# Altium schematic sheet Connectors&Periph.SchDoc: Hi
size A4 portrait; Cel: Ehh; Projektant: Teodor
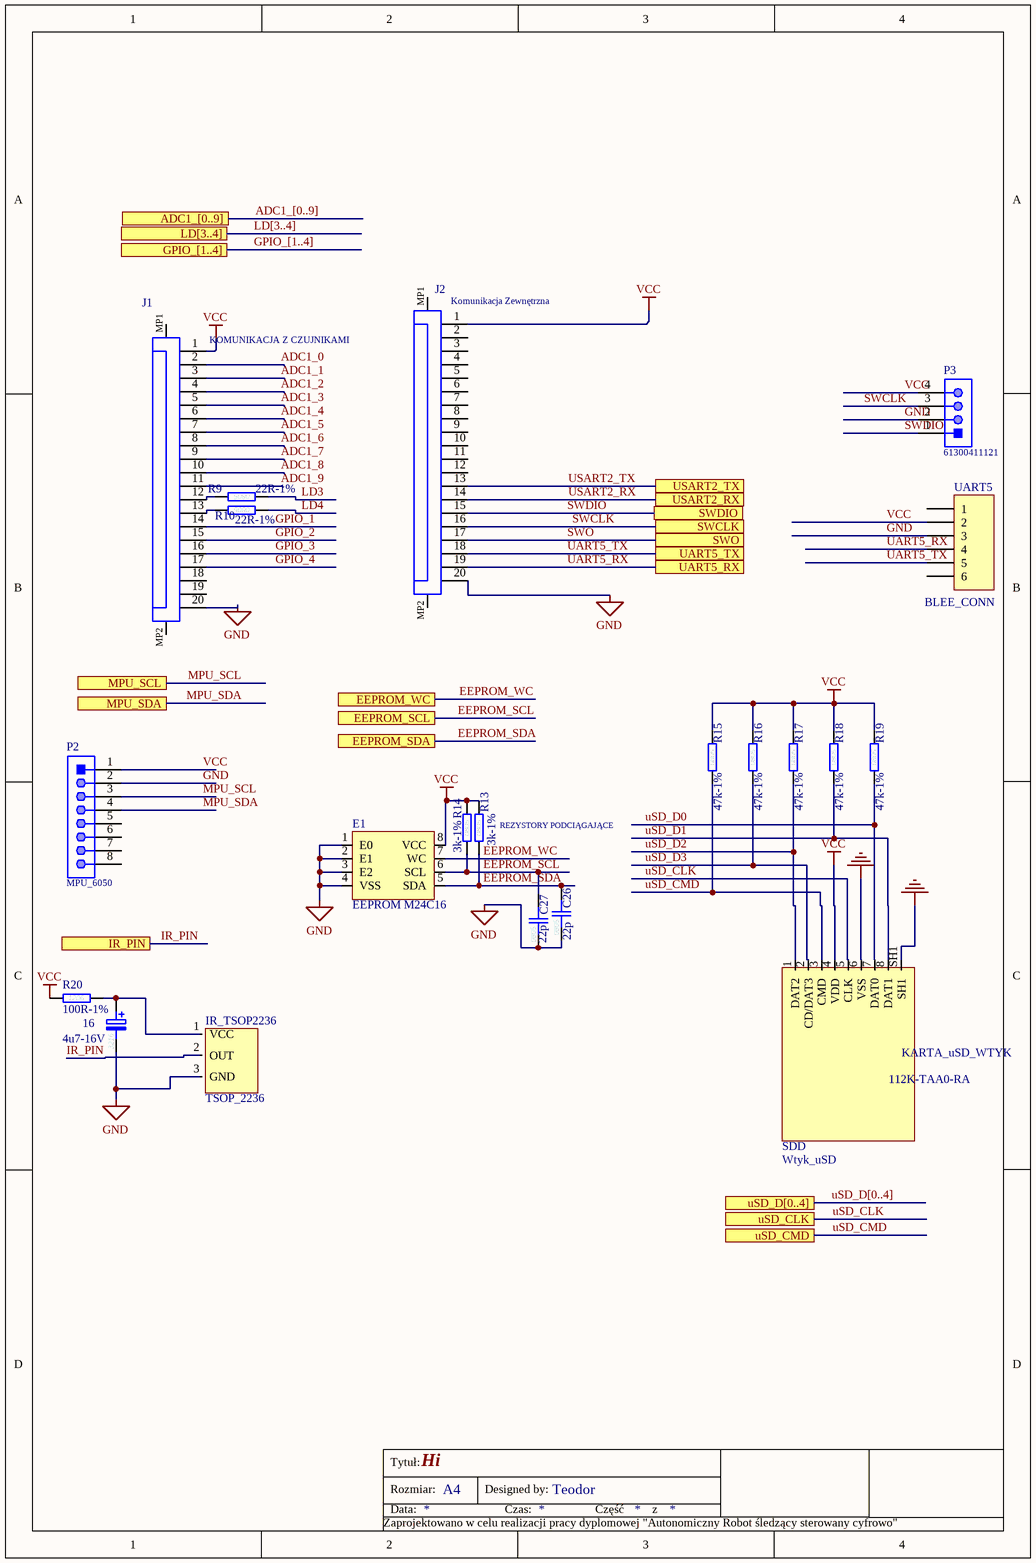
[diagram p0: Connectors&Periph.SchDoc]

## Parts
16  4u7-16V  [3216-SMDA]
C26  22p  [0805C]
C27  22p  [0805C]
E1  EEPROM M24C16  [SOP8EEPROM]
IR_TSOP2236  TSOP_2236  [TSOP2236+high]
J1  KOMUNIKACJA Z CZUJNIKAMI  [687120183722]
J2  Komunikacja Zewnętrzna  [687120183722]
P2  MPU_6050  [61300811121]
P3  61300411121  [61300411121]
R9  22R-1%  [0805R]
R10  22R-1%  [0805R]
R13  3k-1%  [0805R]
R14  3k-1%  [0805R]
R15  47k-1%  [0805R]
R16  47k-1%  [0805R]
R17  47k-1%  [0805R]
R18  47k-1%  [0805R]
R19  47k-1%  [0805R]
R20  100R-1%  [1206R]
SDD  Wtyk_uSD  [112K-TAA0-RA1]
UART5  BLEE_CONN  [HDR1X6]

## Ports
ADC1_[0..9], EEPROM_SCL, EEPROM_SDA, EEPROM_WC, GPIO_[1..4], IR_PIN, LD[3..4], MPU_SCL, MPU_SDA, SWCLK, SWDIO, SWO, UART5_RX, UART5_TX, USART2_RX, USART2_TX, uSD_CLK, uSD_CMD, uSD_D[0..4]

## Nets
GND: 16.2 C26.2 C27.2 E1.1(E0) E1.2(E1) E1.3(E2) E1.4(VSS) IR_TSOP2236.3(GND) J1.20 J2.20 P2.2 P3.2 SDD.6(VSS) SDD.SH1 UART5.3
VCC: E1.8(VCC) J1.1 J2.1 P2.1 P3.4 R13.1 R14.1 R15.1 R16.1 R17.1 R18.1 R19.1 R20.1 SDD.4(VDD) UART5.2
ADC1_0: J1.2
ADC1_1: J1.3
ADC1_2: J1.4
ADC1_3: J1.5
ADC1_4: J1.6
ADC1_5: J1.7
ADC1_6: J1.8
ADC1_7: J1.9
ADC1_8: J1.10
ADC1_9: J1.11
EEPROM_SCL: C27.1 E1.6(SCL) R14.2 ; port EEPROM_SCL
EEPROM_SDA: C26.1 E1.5(SDA) R13.2 ; port EEPROM_SDA
EEPROM_WC: E1.7(WC) ; port EEPROM_WC
GPIO_1: J1.14
GPIO_2: J1.15
GPIO_3: J1.16
GPIO_4: J1.17
IR_PIN: IR_TSOP2236.2(OUT) ; port IR_PIN
LD3: R9.2
LD4: R10.2
MPU_SCL: P2.3 ; port MPU_SCL
MPU_SDA: P2.4 ; port MPU_SDA
SWCLK: J2.16 P3.3 ; port SWCLK
SWDIO: J2.15 P3.1 ; port SWDIO
SWO: J2.17 ; port SWO
UART5_RX: J2.19 UART5.4 ; port UART5_RX
UART5_TX: J2.18 UART5.5 ; port UART5_TX
USART2_RX: J2.14 ; port USART2_RX
USART2_TX: J2.13 ; port USART2_TX
uSD_CLK: SDD.5(CLK) ; port uSD_CLK
uSD_CMD: R15.2 SDD.3(CMD) ; port uSD_CMD
uSD_D0: R19.2 SDD.7(DAT0)
uSD_D1: R18.2 SDD.8(DAT1)
uSD_D2: R17.2 SDD.1(DAT2)
uSD_D3: R16.2 SDD.2(CD/DAT3)
Net16_1: 16.1 IR_TSOP2236.1(VCC) R20.2
NetJ1_12: J1.12 R9.1
NetJ1_13: J1.13 R10.1

Not connected (* = marked no-connect by the designer): J1 18 19 MP1 MP2; J2 2 3 4 5 6 7 8 9 10 11 12 MP1 MP2; P2 5 6 7 8; UART5 1 6

## Buses and harness runs
bus ADC1_[0..9] = port ADC1_[0..9]
bus GPIO_[1..4] = port GPIO_[1..4]
bus LD[3..4] = port LD[3..4]
bus uSD_D[0..4] = port uSD_D[0..4]

## Notes on the sheet
- REZYSTORY PODCIĄGAJĄCE
- Tytuł:
- Rozmiar:
- Data:
- A4
- Designed by:
- Czas:
- Część
- z
- Zaprojektowano w celu realizacji pracy dyplomowej "Autonomiczny Robot śledzący sterowany cyfrowo"
- (in symbol 3k-1%  0805) 0805
- (in symbol 4u7-16V  3216) 3216
- (in symbol 22p  0805) 0805
- (in symbol 22R-1%  0805) 0805
- (in symbol 47k-1%  0805) 0805
- (in symbol 100R-1%  1206) 1206
- (in symbol 112K-TAA0-RA1) KARTA_uSD_WTYK; 112K-TAA0-RA

## Library data of the parts
16 = 4u7-16V  3216: Kond. tantalowy  A  16V  20%; Indeks: 20462; Nazwa: 4u7-16V
C26 C27 = 22p  0805: Kond. ceramiczny NP0  50V; Nazwa: 22p
J1 J2 = CMP-1502-01579-1: SMT ZIF Connectors Low Profile WR-FPC, Horizontal, Bottom Contact, pitch 0.5 mm, 20 pins; Manufacturer: Wurth Elektronik; Rated Current: 0.4A; Pin Number: 20; Withstanding Voltage: 250VAC; Contact Resistance: 30mOhm; Working Voltage: 50VAC; Pitch: 0.5mm; Package Reference: 687120183722; Publisher: WurthElektronik; Packaging: TapeandReel; Part Number: 687120183722; Operating Temperature: -25to85degC; Orientation: Horizontal; Datasheet URL: https://katalog.we-online.de/em/datasheet/687120183722.pdf; Contact Design: BottomContact; Manufacturer URL: http://www.we-online.de; Mounting Technology: SMT
P2 = CMP-1502-01076-1: THT Vertical Pin Header WR-PHD, Pitch 2.54 mm, Single Row, 8 pins; Manufacturer: Wurth Elektronik; Rated Current: 3A; Pin Number: 8; Working Voltage: 250VAC; Gender: Male; Contact Resistance: 20mOhm; Pitch: 2.54mm; Withstanding Voltage: 500VAC; Publisher: WurthElektronik; Operating Temperature: -40to105degC; Orientation: Vertical; Row Number: Single; Part Number: 61300811121; Package Reference: 61300811121; Mounting Technology: THT; Packaging: Bag; Manufacturer URL: http://www.we-online.de; Datasheet URL: https://katalog.we-online.de/em/datasheet/6130xx11121.pdf
P3 = CMP-1502-01064-1: SWD; Manufacturer: Wurth Elektronik; Withstanding Voltage: 500VAC; Rated Current: 3A; Working Voltage: 250VAC; Pin Number: 4; Gender: Male; Row Number: Single; Contact Resistance: 20mOhm; Pitch: 2.54mm; Manufacturer URL: http://www.we-online.de; Operating Temperature: -40to105degC; Packaging: Bag; Mounting Technology: THT; Package Reference: 61300411121; Datasheet URL: https://katalog.we-online.de/em/datasheet/6130xx11121.pdf; Publisher: WurthElektronik; Part Number: 61300411121; Orientation: Vertical
R9 R10 = 22R-1%  0805: Rezystor 0,125W; Nazwa: 22R-1%
R13 R14 = 3k-1%  0805: Rezystor 0,125W; Nazwa: 3k-1%
R15-R19 = 47k-1%  0805: Rezystor 0,125W; Nazwa: 47k-1%
R20 = 100R-1%  1206: Rezystor 0,25W; Nazwa: 100R-1%
SDD = 112K-TAA0-RA1
UART5 = Header 6: Header, 6-Pin; LatestRevisionDate: 17-Jul-2002; LatestRevisionNote: Re-released for DXP Platform.; Publisher: Altium Limited